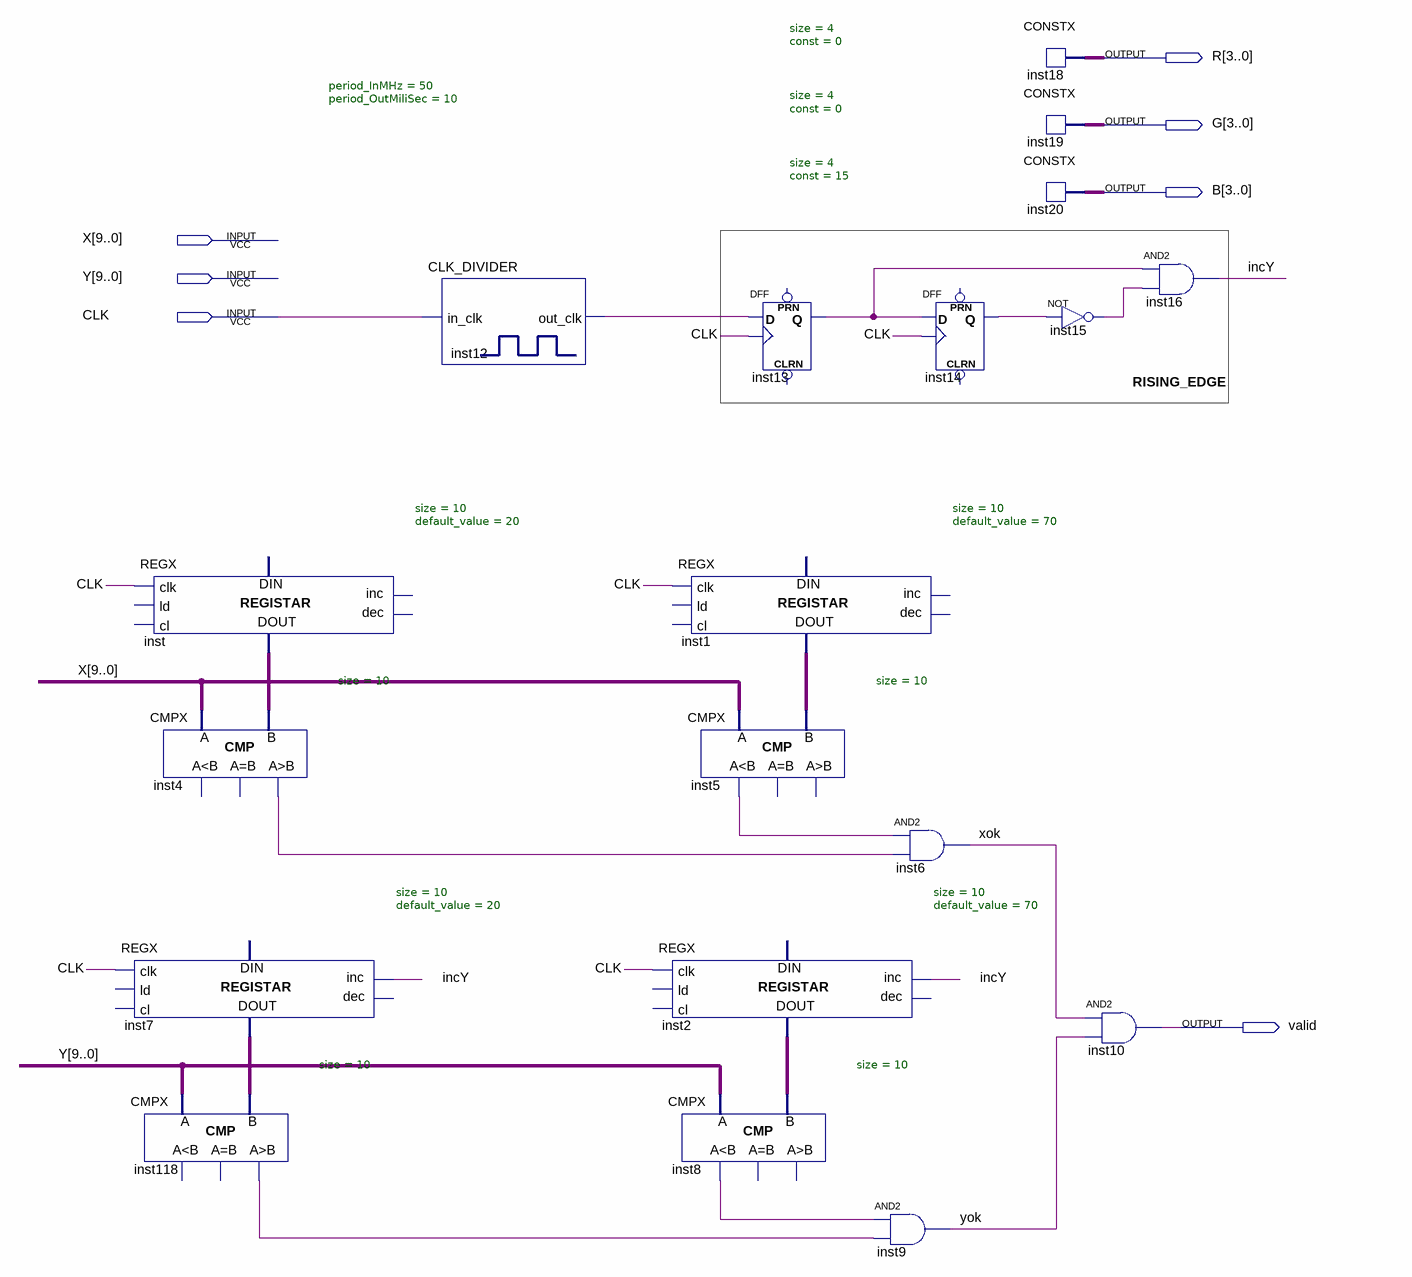
[diagram p0: schematic sheet]
// Quartus schematic Layer1.bdf as structural Verilog: 19 symbols, 7 pins
module Layer1 (
  input  [9:0] X,
  input  [9:0] Y,
  input  CLK,
  output [3:0] R,
  output [3:0] G,
  output [3:0] B,
  output valid
);

  wire incY, inst4_gr, inst5_ls, inst8_ls, inst12_out_clk, inst13_q, inst14_q, inst15_out, inst118_gr, xok,
       yok;
  wire [9:0] inst1_data_out, inst2_data_out, inst7_data_out, inst_data_out;

  REGX #(.size(10), .default_value(20)) inst (.clk(CLK), .data_out(inst_data_out));  // open: ld, cl, inc, dec, data_in
  CMPX #(.size(10)) inst4 (.A(X), .B(inst_data_out), .gr(inst4_gr));  // open: ls, eq
  REGX #(.size(10), .default_value(20)) inst7 (
    .clk(CLK), .inc(incY), .data_out(inst7_data_out));  // open: ld, cl, dec, data_in
  CMPX #(.size(10)) inst118 (.A(Y), .B(inst7_data_out), .gr(inst118_gr));  // open: ls, eq
  CLK_DIVIDER #(.period_InMHz(50), .period_OutMiliSec(10)) inst12 (.in_clk(CLK), .out_clk(inst12_out_clk));
  REGX #(.size(10), .default_value(70)) inst1 (
    .clk(CLK), .data_out(inst1_data_out));  // open: ld, cl, inc, dec, data_in
  CMPX #(.size(10)) inst5 (.A(X), .B(inst1_data_out), .ls(inst5_ls));  // open: eq, gr
  REGX #(.size(10), .default_value(70)) inst2 (
    .clk(CLK), .inc(incY), .data_out(inst2_data_out));  // open: ld, cl, dec, data_in
  CMPX #(.size(10)) inst8 (.A(Y), .B(inst2_data_out), .ls(inst8_ls));  // open: eq, gr
  DFF inst13 (.CLK(CLK), .D(inst12_out_clk), .Q(inst13_q));  // open: CLRN, PRN
  and inst9 (yok, inst8_ls, inst118_gr);
  DFF inst14 (.CLK(CLK), .D(inst13_q), .Q(inst14_q));  // open: CLRN, PRN
  and inst6 (xok, inst5_ls, inst4_gr);
  CONSTX #(.size(4), .\const (0)) inst18 (.data(R));
  CONSTX #(.size(4), .\const (0)) inst19 (.data(G));
  CONSTX #(.size(4), .\const (15)) inst20 (.data(B));
  not inst15 (inst15_out, inst14_q);
  and inst10 (valid, xok, yok);
  and inst16 (incY, inst13_q, inst15_out);

  // Notes on the sheet:
  //   RISING_EDGE
endmodule
